# EAGLE design terrarium board (EAGLE 6.5.0)
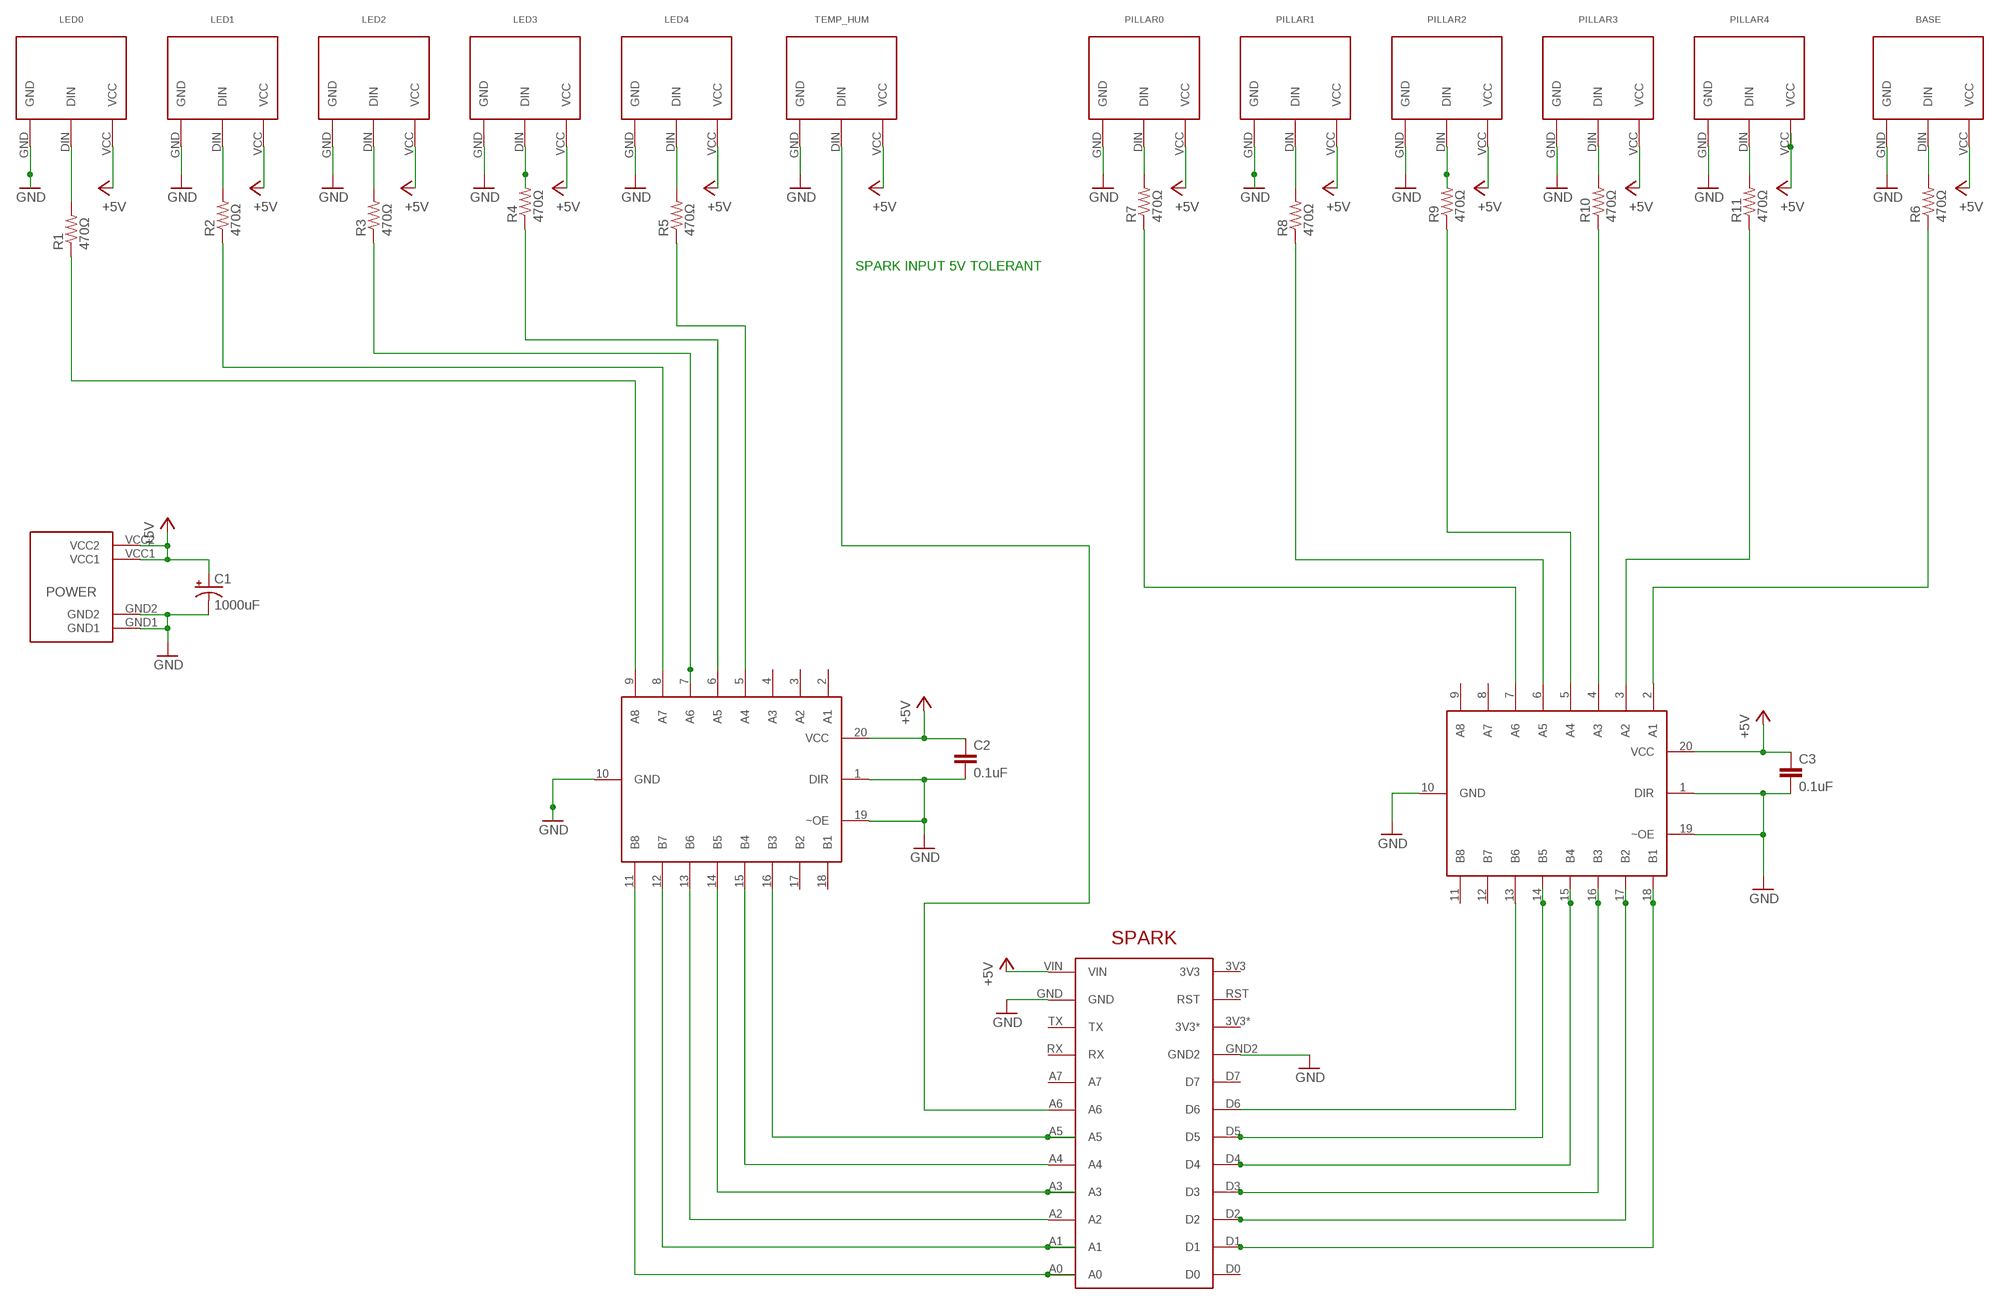
[diagram p0: schematic, sheet 1]

## Parts
BASE  MOLEX_3PIN_SMT_43650-310  [MOLEX_3PIN_SMT_43650-310]
C1  1000uF  CAP_POLPTH4  [CPOL-RADIAL-1000UF-25V]
C2  0.1uF  CAP0805  [0805]
C3  0.1uF  CAP0805  [0805]
LED0  MOLEX_3PIN_SMT_43650-310  [MOLEX_3PIN_SMT_43650-310]
LED1  MOLEX_3PIN_SMT_43650-310  [MOLEX_3PIN_SMT_43650-310]
LED2  MOLEX_3PIN_SMT_43650-310  [MOLEX_3PIN_SMT_43650-310]
LED3  MOLEX_3PIN_SMT_43650-310  [MOLEX_3PIN_SMT_43650-310]
LED4  MOLEX_3PIN_SMT_43650-310  [MOLEX_3PIN_SMT_43650-310]
PILLAR0  MOLEX_3PIN_SMT_43650-310  [MOLEX_3PIN_SMT_43650-310]
PILLAR1  MOLEX_3PIN_SMT_43650-310  [MOLEX_3PIN_SMT_43650-310]
PILLAR2  MOLEX_3PIN_SMT_43650-310  [MOLEX_3PIN_SMT_43650-310]
PILLAR3  MOLEX_3PIN_SMT_43650-310  [MOLEX_3PIN_SMT_43650-310]
PILLAR4  MOLEX_3PIN_SMT_43650-310  [MOLEX_3PIN_SMT_43650-310]
POWER  MOLEX_2PIN_SABRE_POWER  [MOLEX_2PIN_SABRE_POWER]
R1  470Ω  RESISTOR0805-RES  [0805]
R2  470Ω  RESISTOR0805-RES  [0805]
R3  470Ω  RESISTOR0805-RES  [0805]
R4  470Ω  RESISTOR0805-RES  [0805]
R5  470Ω  RESISTOR0805-RES  [0805]
R6  470Ω  RESISTOR0805-RES  [0805]
R7  470Ω  RESISTOR0805-RES  [0805]
R8  470Ω  RESISTOR0805-RES  [0805]
R9  470Ω  RESISTOR0805-RES  [0805]
R10  470Ω  RESISTOR0805-RES  [0805]
R11  470Ω  RESISTOR0805-RES  [0805]
SHIFT1  TI_74HCT245DWR  [SOIC-20]
SHIFT2  TI_74HCT245DWR  [SOIC-20]
SPARK  SPARKCORE  [SPARKCORE]
TEMP_HUM  MOLEX_3PIN_SMT_43650-310  [MOLEX_3PIN_SMT_43650-310]

## Nets
+5V [power]: BASE.VCC C1.1(+) C2.1 C3.1 LED0.VCC LED1.VCC LED2.VCC LED3.VCC LED4.VCC PILLAR0.VCC PILLAR1.VCC PILLAR2.VCC PILLAR3.VCC PILLAR4.VCC POWER.VCC1 POWER.VCC2 SHIFT1.20(VCC) SHIFT2.20(VCC) SPARK.VIN TEMP_HUM.VCC
GND [power]: BASE.GND C1.2(-) C2.2 C3.2 LED0.GND LED1.GND LED2.GND LED3.GND LED4.GND PILLAR0.GND PILLAR1.GND PILLAR2.GND PILLAR3.GND PILLAR4.GND POWER.GND1 POWER.GND2 SHIFT1.1(DIR) SHIFT1.10(GND) SHIFT1.19(~OE) SHIFT2.1(DIR) SHIFT2.10(GND) SHIFT2.19(~OE) SPARK.GND SPARK.GND2 TEMP_HUM.GND
N$2: SHIFT2.17(B2) SPARK.D2
N$3: PILLAR0.DIN R7.2
N$4: LED0.DIN R1.2
N$5: R1.1 SHIFT1.9(A8)
N$6: LED1.DIN R2.2
N$7: LED2.DIN R3.2
N$8: LED3.DIN R4.2
N$9: LED4.DIN R5.2
N$10: R6.1 SHIFT2.2(A1)
N$11: BASE.DIN R6.2
N$12: SPARK.A6 TEMP_HUM.DIN
N$13: R11.1 SHIFT2.3(A2)
N$14: PILLAR1.DIN R8.2
N$15: R10.1 SHIFT2.4(A3)
N$16: PILLAR2.DIN R9.2
N$17: PILLAR3.DIN R10.2
N$18: PILLAR4.DIN R11.2
N$19: R2.1 SHIFT1.8(A7)
N$20: R3.1 SHIFT1.7(A6)
N$21: R4.1 SHIFT1.6(A5)
N$22: R5.1 SHIFT1.5(A4)
N$23: R9.1 SHIFT2.5(A4)
N$24: R8.1 SHIFT2.6(A5)
N$25: R7.1 SHIFT2.7(A6)
N$26: SHIFT2.13(B6) SPARK.D6
N$30: SHIFT2.18(B1) SPARK.D1
N$31: SHIFT2.16(B3) SPARK.D3
N$32: SHIFT2.14(B5) SPARK.D5
N$33: SHIFT2.15(B4) SPARK.D4
N$34: SHIFT1.11(B8) SPARK.A0
N$35: SHIFT1.12(B7) SPARK.A1
N$36: SHIFT1.13(B6) SPARK.A2
N$37: SHIFT1.14(B5) SPARK.A3
N$38: SHIFT1.15(B4) SPARK.A4
N$39: SHIFT1.16(B3) SPARK.A5
Unconnected: SHIFT1.2(A1) SHIFT1.3(A2) SHIFT1.4(A3) SHIFT1.17(B2) SHIFT1.18(B1) SHIFT2.8(A7) SHIFT2.9(A8) SHIFT2.11(B8) SHIFT2.12(B7) SPARK.3V3 SPARK.3V3* SPARK.A7 SPARK.D0 SPARK.D7 SPARK.RST SPARK.RX SPARK.TX

## Notes on the sheet
- SPARK INPUT 5V TOLERANT

## Library data of the parts
BASE LED0 LED1-LED4 PILLAR0 PILLAR1-PILLAR4 TEMP_HUM = tjw:MOLEX_3PIN_SMT_43650-310
C1 = SparkFun-Passives:CAP_POL: Capacitor Polarized These are standard SMD and PTH capacitors. Normally 10uF, 47uF, and 100uF in electrolytic and tantalum varieties. Always verify the external diameter of the through hole cap, it varies with capacity, voltage, and manufacturer. The EIA devices should be standard.
C2 C3 = SparkFun-Capacitors:CAP: Capacitor Standard 0603 ceramic capacitor, and 0.1" leaded capacitor.
POWER = tjw:MOLEX_2PIN_SABRE_POWER
R1-R11 = SparkFun-Passives:RESISTOR: Resistor Basic schematic elements and footprints for 0603, 1206, and PTH resistors.
SHIFT1 SHIFT2 = tjw:TI_74HCT245DWR
SPARK = tjw:SPARKCORE: Spark Core

## Net classes
1 power: width 1.524 mm

## Board
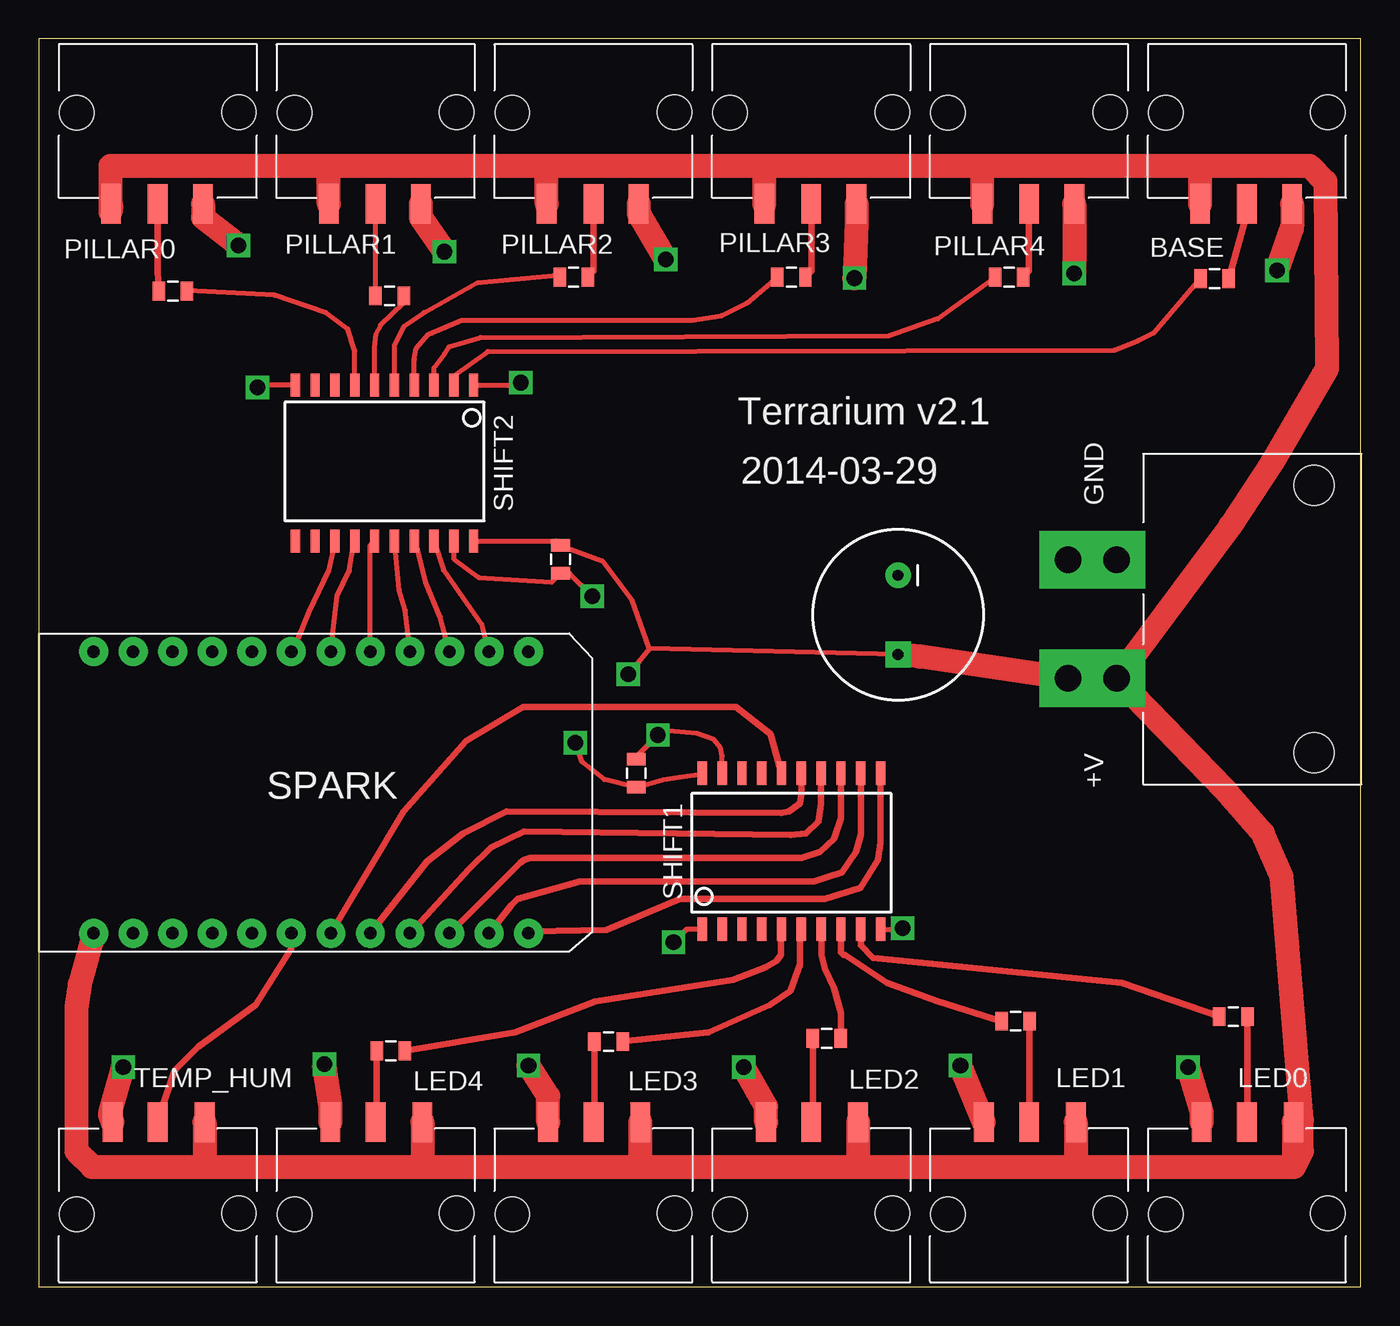
[diagram p1: board, top side]
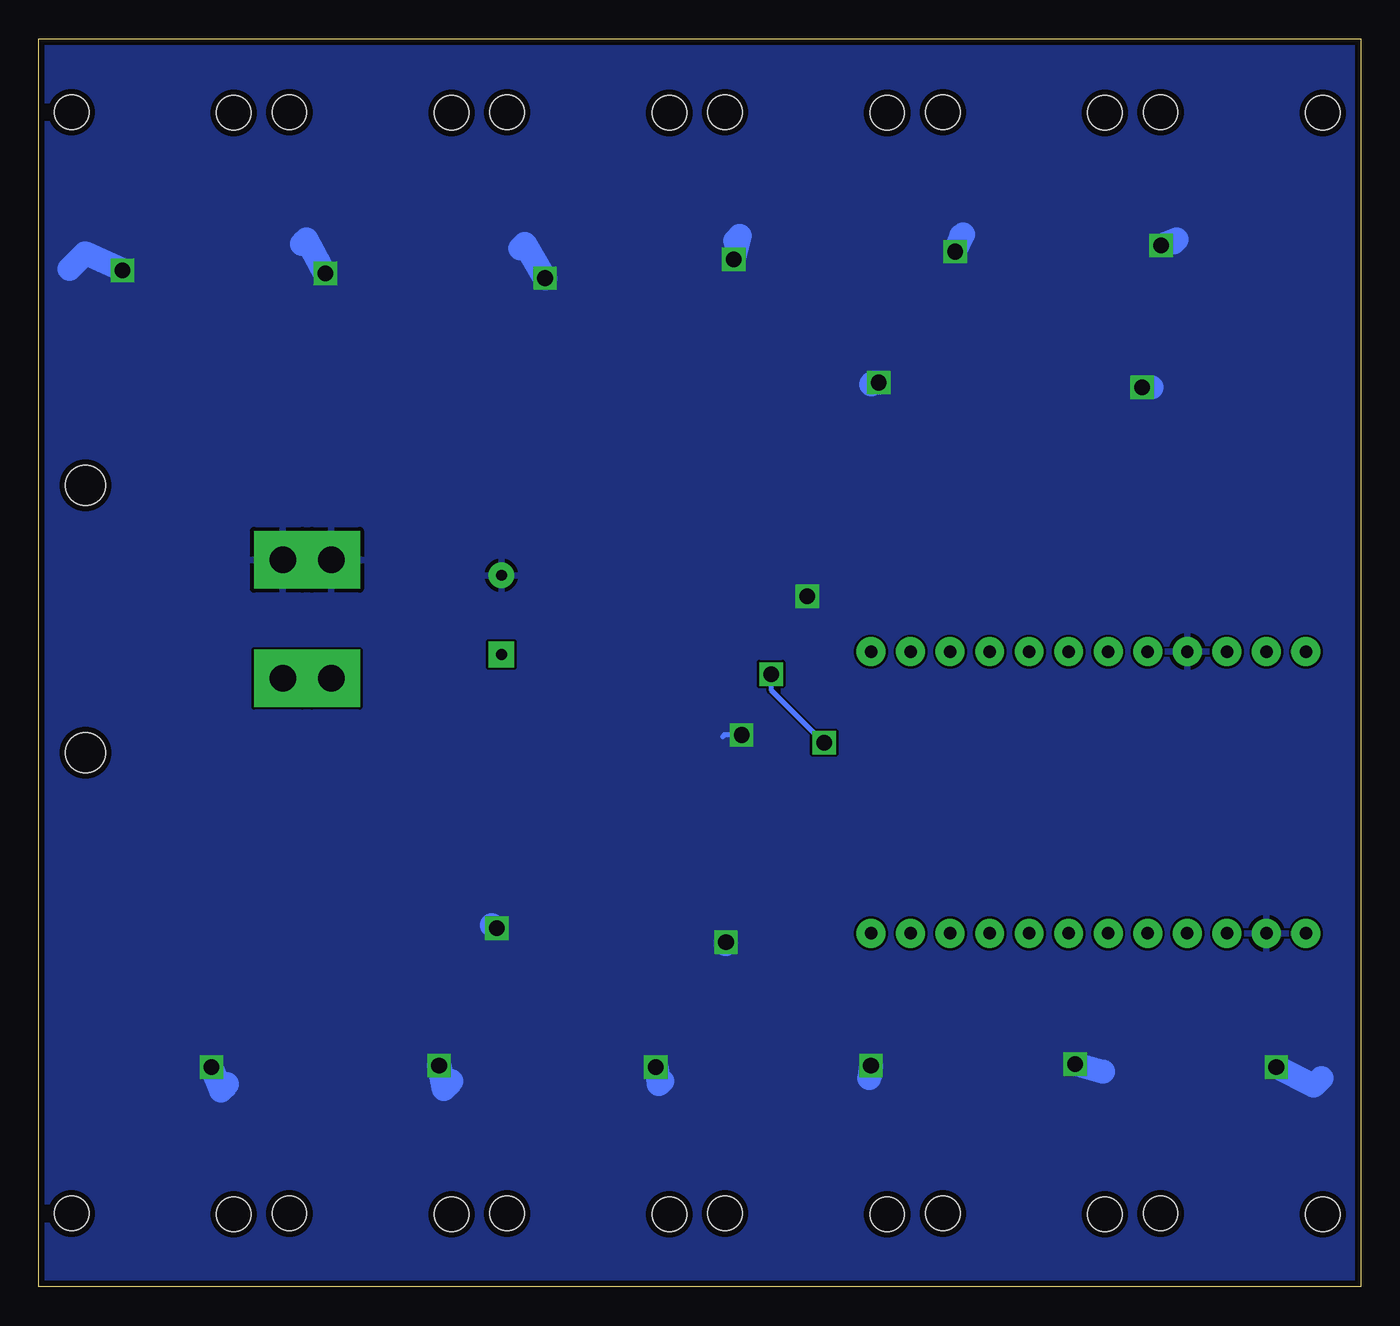
[diagram p2: board, bottom side, seen from below]

Size 84.76 x 80.04 mm. Coordinates in mm from the lower left corner, seen from the top.
Outline: 0,0 84.76,0 84.76,80.04 0,80.04 0,0
Copper layers (1*16): Top 0.0356mm / dielectric 1.5011mm / Bottom 0.0356mm
Design rules "OSH Park": minimum track width 6mil, minimum drill 13mil, track to track 6mil, track to pad 6mil, pad to pad 6mil, via to via 6mil, smd to smd 6mil, copper to edge 15mil, drill to drill 6mil, minimum pad ring 7mil, minimum via ring 7mil, stop-mask expansion 3mil, vias tented up to drill 0mil, thermal gap 10mil

### Footprints (pad centres in the part's own frame; a part is rotated, then mirrored left to right if it is on the bottom)
MOLEX_3PIN_SMT_43650-310 = smd 1.27 x 2.54: DIN 6.35,-0.4; GND 9.25,-0.4; VCC 3.35,-0.4 | hole 2.2: 1.15,5.45; 11.55,5.5
CPOL-RADIAL-1000UF-25V = drill 0.7 pad 1.651 square: 1 2.54,0 | drill 0.7 pad 1.651: 2 -2.54,0
0805 = smd 0.8 x 1.2: 1 -0.9,0; 2 0.9,0
MOLEX_2PIN_SABRE_POWER = drill 1.7 pad 3.7 square: GND1 6.8,-1.7; GND2 6.8,-4.8; VCC1 14.4,-1.7; VCC2 14.4,-4.8 | hole 2.55: 2.025,10.95; 19.175,10.95
SOIC-20 = smd 0.6 x 1.5: 1 -5.715,-5; 2 -4.445,-5; 3 -3.175,-5; 4 -1.905,-5; 5 -0.635,-5; 6 0.635,-5; 7 1.905,-5; 8 3.175,-5; 9 4.445,-5; 10 5.715,-5; 11 5.715,5; 12 4.445,5; 13 3.175,5; 14 1.905,5; 15 0.635,5; 16 -0.635,5; 17 -1.905,5; 18 -3.175,5; 19 -4.445,5; 20 -5.715,5
SPARKCORE = drill 0.8 pad 1.85: 3V3 1.165,3.5; 3V3* 1.165,8.573; A0 19.235,31.399; A1 19.235,28.863; A2 19.235,26.327; A3 19.235,23.79; A4 19.235,21.254; A5 19.235,18.718; A6 19.235,16.182; A7 19.235,13.645; D0 1.165,31.399; D1 1.165,28.863; D2 1.165,26.327; D3 1.165,23.79; D4 1.165,21.254; D5 1.165,18.718; D6 1.165,16.181; D7 1.165,13.645; GND 19.235,6.036; GND2 1.165,11.109; RST 1.165,6.036; RX 19.235,11.109; TX 19.235,8.572; VIN 19.235,3.5

### Placement (x,y rotation side)
BASE  71.12,69.85 0 top
C1  55.1,43.1 270 top
C2  38.3,32.94 90 top
C3  33.45,46.66 270 top
LED0  83.82,10.16 180 top
LED1  69.85,10.16 180 top
LED2  55.88,10.16 180 top
LED3  41.91,10.16 180 top
LED4  27.94,10.16 180 top
PILLAR0  1.27,69.85 0 top
PILLAR1  15.24,69.85 0 top
PILLAR2  29.21,69.85 0 top
PILLAR3  43.18,69.85 0 top
PILLAR4  57.15,69.85 0 top
POWER  70.82,53.43 270 top
R1  76.6,17.34 0 top
R2  62.63,17.04 0 top
R3  50.53,15.94 180 top
R4  36.53,15.74 180 top
R5  22.56,15.14 180 top
R6  75.4,64.67 0 top
R7  8.59,63.87 180 top
R8  22.49,63.57 180 top
R9  34.29,64.77 0 top
R10  48.26,64.77 0 top
R11  62.23,64.77 0 top
SHIFT1  48.26,27.94 0 top
SHIFT2  22.16,52.84 180 top
SPARK  0,41.91 270 top
TEMP_HUM  13.97,10.16 180 top

### Tracks (layer width: path | path; a pad name or v marks a point on that pad's centre or on a via)
+5V  (via drill 1)
  Top 0.305: C1.1 39.16,40.96 | 39.16,40.96 v37.8,39.3 | v34.4,34.9 34.8,33.7 36.26,32.54 C2.1 40.04,32.54 41.1,32.7 42.51,32.9 SHIFT1.20 | SHIFT2.20 33.17,47.84 C3.1 36.14,46.56 38,44.1 39.1,41 39.16,40.96
  Top 1.53: POWER.VCC1 POWER.VCC2 56.5,40.43 C1.1 | PILLAR0.VCC 4.6,68.95 4.6,71.9 18.6,71.9 | 18.6,71.9 32.6,71.9 | 32.6,71.9 46.6,71.9 | 46.6,71.9 60.3,71.9 | 60.3,71.9 74.3,71.9 | 74.3,71.9 81.5,71.9 82.5,70.9 82.6,58.9 79.1,52.9 76.4,48.81 POWER.VCC1 | BASE.VCC 74.47,71.73 74.3,71.9 | PILLAR4.VCC 60.5,71.7 60.3,71.9 | PILLAR3.VCC 46.53,71.83 46.6,71.9 | PILLAR2.VCC 32.56,71.86 32.6,71.9 | PILLAR1.VCC 18.59,71.89 18.6,71.9 | SPARK.VIN 2.6,19.4 2.4,17.9 2.4,8.7 3.4,7.7 10.3,7.7 | 10.3,7.7 24.5,7.7 | 24.5,7.7 38.4,7.7 | 38.4,7.7 52.6,7.7 | 52.6,7.7 66.6,7.7 | 66.6,7.7 80.5,7.7 | 80.5,7.7 81,8.7 81,10.7 79.7,26.3 78.5,29.1 76.1,31.85 POWER.VCC1 | LED0.VCC 80.47,7.73 80.5,7.7 | LED1.VCC 66.5,7.8 66.6,7.7 | LED2.VCC 52.53,7.77 52.6,7.7 | LED3.VCC 38.56,7.86 38.4,7.7 | LED4.VCC 24.59,7.79 24.5,7.7 | TEMP_HUM.VCC 10.62,8.02 10.3,7.7
  Bottom 0.305: v37.8,39.3 37.8,38.3 v34.4,34.9
GND  (via drill 1)
  Top 0.305: SHIFT1.10 55.34,22.94 v55.4,23 | 43.8,32.95 SHIFT1.19 43.81,34.09 43.7,34.59 43.3,35.1 42.2,35.5 40,35.7 v39.7,35.4 38.3,34 C2.2 | SHIFT1.1 41.54,22.94 v40.7,22.1 | SHIFT2.19 26.61,46.7 28.2,45.5 32.89,45.2 C3.2 34.04,45.76 v35.5,44.3 | SHIFT2.10 14.14,57.84 v14,57.7 | SHIFT2.1 30.74,57.84 v30.9,58
  Top 1.53: BASE.GND 80.37,68.03 v79.4,65.2 | PILLAR4.GND v66.4,65 | PILLAR3.GND 52.43,68.27 v52.3,64.7 | PILLAR2.GND 38.46,68.84 v40.2,65.9 | PILLAR1.GND 24.49,68.61 v26,66.4 | PILLAR0.GND 10.52,68.58 v12.8,66.8 | LED4.GND 18.69,11.61 v18.3,14.3 | LED2.GND 46.63,11.57 v45.2,14.1 | LED1.GND v59.1,14.2 | LED0.GND 74.57,11.23 v73.7,14.1 | TEMP_HUM.GND 4.54,11.06 v5.4,14.1 | LED3.GND 32.66,12.24 v31.4,14.2 | POWER.GND1 POWER.GND2
  Bottom 0.305: v39.7,35.4 40.8,35.4 40.9,35.3 | 40.7,22 40.6,21.9 | v35.5,44.3 35.5,44.2 36,43.7
  Bottom 1.53: v79.4,65.2 81.8,66.3 82.8,65.3 | v66.4,65 67.6,67.2 67.9,66.9 | v52.3,64.7 53.6,66.9 53.9,66.6 | v40.2,65.9 39.8,67.4 40.1,67.1 | v26,66.4 25.5,67.5 25.6,67.4 | v12.8,66.8 11.8,67.2 12,67 | v18.3,14.3 16.5,13.8 | v45.2,14.1 45,13 44.8,13.2 | v59.1,14.2 58.8,12.7 58.3,13.2 | v73.7,14.1 73.1,12.6 72.7,13 | v5.4,14.1 3,12.9 2.5,13.4 | v55.4,23 55.5,23 55.7,23.2 | v31.4,14.2 31.5,13.4 | v40.7,22.1 40.7,22 | v14,57.7 13.4,57.7 | v30.9,58 31.3,58 31.4,57.9
  pour Bottom: -1.27,81.28 -1.27,-1.27 102.87,-1.27 102.87,82.55 0,82.55 -1.27,82.55
N$2
  Top 0.305: SPARK.D2 25.73,42.97 24.8,45.2 24.2,47.7 SHIFT2.17
N$3
  Top 0.406: PILLAR0.DIN 7.62,65.14 R7.2
N$4
  Top 0.406: R1.2 77.5,11.09 LED0.DIN
N$5
  Top 0.406: SHIFT1.9 52.7,21.89 53.5,21.1 69.44,19.5 R1.1
N$6
  Top 0.406: R2.2 63.53,11.09 LED1.DIN
N$7
  Top 0.406: R3.2 49.63,11.16 LED2.DIN
N$8
  Top 0.406: R4.2 35.63,11.13 LED3.DIN
N$9
  Top 0.406: R5.2 21.66,11.13 LED4.DIN
N$10
  Top 0.305: SHIFT2.2 26.61,58.41 28.8,60 69,60.1 70.5,60.7 71.53,61.2 R6.1
N$11
  Top 0.406: R6.2 77.5,68.92 BASE.DIN
N$12
  Top 0.406: SPARK.A6 16.18,21.68 13.9,18.1 10.2,15.4 8.7,13.9 7.8,11.24 TEMP_HUM.DIN
N$13
  Top 0.305: SHIFT2.3 25.34,58.94 26,59.84 26.3,60.3 28.3,60.9 54.5,61 57.6,62.1 57.66,62.1 R11.1
N$14
  Top 0.305: R8.2 PILLAR1.DIN
N$15
  Top 0.305: SHIFT2.4 24.07,59.47 24.2,60.16 25,61.1 27.1,62 41.9,62 43.8,62.3 45.4,63.11 R10.1
N$16
  Top 0.406: PILLAR2.DIN 35.56,65.14 R9.2
N$17
  Top 0.406: PILLAR3.DIN 49.53,65.14 R10.2
N$18
  Top 0.406: PILLAR4.DIN 63.5,65.14 R11.2
N$19
  Top 0.406: SHIFT1.8 51.44,21.46 51.6,21.3 51.7,21.3 54.4,19.5 57.67,18.3 R2.1
N$20
  Top 0.406: R3.1 51.43,17.57 51,19.17 50.4,20.4 50.2,21.3 50.2,22.91 SHIFT1.7
N$21
  Top 0.406: R4.1 42.94,16.34 46.9,18.1 48.2,19 48.8,20.7 48.8,22.84 SHIFT1.6
N$22
  Top 0.406: R5.1 30.54,16.34 35.7,18.3 44.5,19.7 46.6,20.5 47.3,20.9 47.6,21.3 47.6,22.91 SHIFT1.5
N$23
  Top 0.305: SHIFT2.5 22.8,60.4 23.4,61.59 24.7,62.5 28.1,64.4 33.26,64.9 R9.1
N$24
  Top 0.305: R8.1 23.39,63.09 21.9,61.7 21.6,61.1 21.5,60.2 21.5,57.87 SHIFT2.6
N$25
  Top 0.305: SHIFT2.7 20.25,60.05 19.8,61.45 18.4,62.5 15.1,63.6 9.52,63.9 R7.1
N$26
  Top 0.305: SHIFT2.13 18.59,45.98 17.3,43.3 16.3,40.86 SPARK.D6
N$30
  Top 0.305: SHIFT2.18 25.93,45.97 28.4,42.5 28.8,40.81 SPARK.D1
N$31
  Top 0.305: SPARK.D3 23.49,43.41 23.1,44.7 SHIFT2.16
N$32
  Top 0.305: SPARK.D5 19.12,44.32 19.9,45.9 20.2,47.78 SHIFT2.14
N$33
  Top 0.305: SPARK.D4 21.25,47.57 SHIFT2.15
N$34
  Top 0.406: SHIFT1.11 53.98,28.48 53.8,27.38 52.7,25.6 50.4,24.9 41.1,24.9 36.4,22.9 31.52,22.8 SPARK.A0
N$35
  Top 0.406: SHIFT1.12 52.7,29 52.4,27.91 51.5,26.6 49.7,26 34.7,26 30.7,24.9 30.3,24.51 SPARK.A1
N$36
  Top 0.406: SHIFT1.13 51.44,30.04 51,28.73 50.1,27.9 48.9,27.5 31.5,27.5 31.1,27.4 30.85,27.2 SPARK.A2
N$37
  Top 0.406: SHIFT1.14 50.16,30.96 50,29.86 49.2,29.1 48.2,29 31.11,29.2 29,28.2 27.6,26.8 SPARK.A3
N$38
  Top 0.406: SHIFT1.15 48.9,31.7 48.8,31 48.1,30.5 47.6,30.4 29.98,30.5 27.2,29.1 24.9,27.3 SPARK.A4
N$39
  Top 0.406: SHIFT1.16 46.92,35.48 44.7,37.2 31.04,37.2 27.4,35 23.4,30.5 SPARK.A5

### Text on the board
tNames: Terrarium v2.1 | 2014-03-29 | SPARK